# Altium schematic sheet Audio.SchDoc
size A4; SheetNumber: 3; SheetTotal: 16
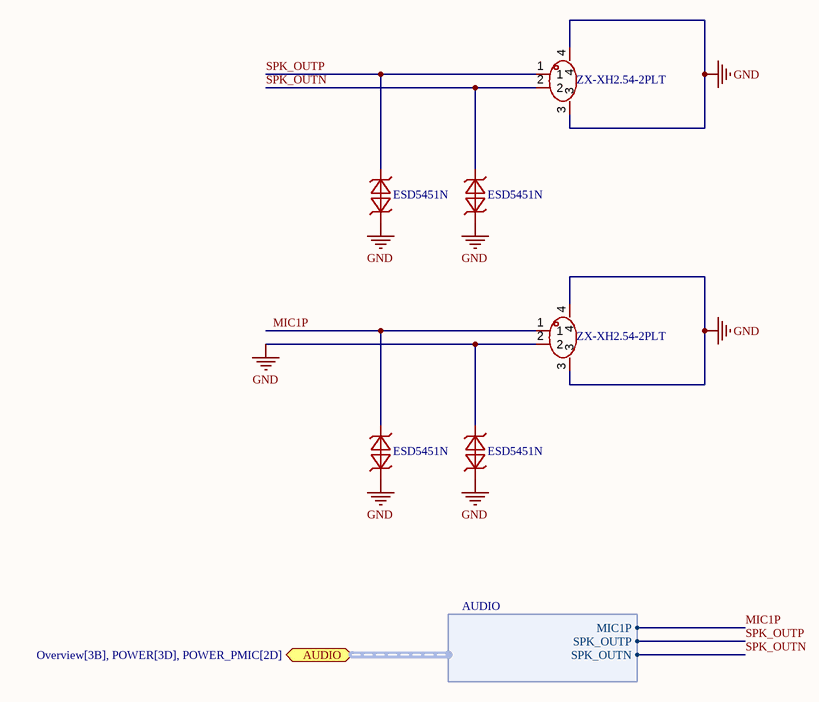
[diagram p0: Audio.SchDoc]

## Parts
(Parts that share a designator on the sheet are numbered #1, #2 ... from top to bottom, then left to right.)
U?#1  ESD5451N  [DFN1006-2L-BI]
U?#2  ESD5451N  [DFN1006-2L-BI]
U?#3  ZX-XH2.54-2PLT  [CONN-SMD_2P-P2.50_HCTL_HC-XH-2ALT]
U?#4  ESD5451N  [DFN1006-2L-BI]
U?#5  ESD5451N  [DFN1006-2L-BI]
U??  ZX-XH2.54-2PLT  [CONN-SMD_2P-P2.50_HCTL_HC-XH-2ALT]

## Ports
AUDIO (bidir, harness AUDIO, see Overview[3B], POWER[3D], POWER_PMIC[2D])

## Harnesses
AUDIO: SPK_OUTP, SPK_OUTN, MIC1P

## Nets
GND: U?#1.1 U?#2.1 U?#3.2 U?#3.3 U?#3.4 U?#4.1 U?#5.1 U?#5.2 U??.3 U??.4
MIC1P: U?#3.1 U?#4.2 ; port AUDIO.MIC1P
SPK_OUTN: U?#2.2 U??.2 ; port AUDIO.SPK_OUTN
SPK_OUTP: U?#1.2 U??.1 ; port AUDIO.SPK_OUTP

## Library data of the parts
U?#1 U?#2 U?#4 U?#5 = ESD5451N: 是双向 TVS（瞬态电压抑制器），专门用于保护连接到低速数据线和控制线的敏感电子元件，使其免受 ESD（静电放电）、EFT（电快速瞬变）和浪涌引起的过应力影响。; Symbol: ESD5451N
U?#3 U?? = ZX-XH2.54-2PLT: ;SMD,P=2.5mm;SMD,P=2.54mm; Symbol: ZX-XH2.54-2PLT